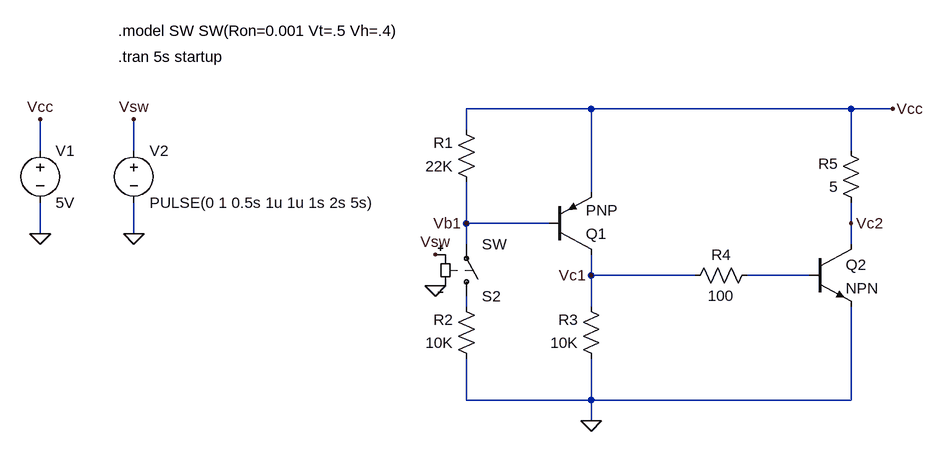
[diagram p0: schematic bjt-biasing-02.asc]
bjt-biasing-02.asc, the LTspice schematic file:
Version 4
SHEET 1 880 680
WIRE 32 -64 -160 -64
WIRE 432 -64 32 -64
WIRE 496 -64 432 -64
WIRE -160 -32 -160 -64
WIRE -816 0 -816 -48
WIRE -672 0 -672 -48
WIRE 432 0 432 -64
WIRE 32 64 32 -64
WIRE -160 112 -160 48
WIRE -32 112 -160 112
WIRE 432 112 432 80
WIRE -816 128 -816 80
WIRE -672 128 -672 80
WIRE -160 144 -160 112
WIRE 432 144 432 112
WIRE 32 192 32 160
WIRE 192 192 32 192
WIRE 368 192 272 192
WIRE -160 240 -160 224
WIRE 32 240 32 192
WIRE -160 384 -160 320
WIRE 32 384 32 320
WIRE 32 384 -160 384
WIRE 432 384 432 240
WIRE 432 384 32 384
WIRE 32 416 32 384
FLAG -816 128 0
FLAG -816 -48 Vcc
FLAG -672 128 0
FLAG -672 -48 Vsw
FLAG 32 416 0
FLAG 496 -64 Vcc
FLAG -160 112 Vb1
FLAG 32 192 Vc1
FLAG -208 160 Vsw
FLAG -208 208 0
FLAG 432 112 Vc2
SYMBOL voltage -816 -16 R0
WINDOW 123 0 0 Left 0
WINDOW 39 0 0 Left 0
SYMATTR InstName V1
SYMATTR Value 5V
SYMBOL res -144 64 R180
WINDOW 0 36 76 Left 2
WINDOW 3 36 40 Left 2
SYMATTR InstName R1
SYMATTR Value 22K
SYMBOL voltage -672 -16 R0
WINDOW 123 0 0 Left 0
WINDOW 39 0 0 Left 0
SYMATTR InstName V2
SYMATTR Value PULSE(0 1 0.5s 1u 1u 1s 2s 5s)
SYMBOL pnp -32 160 M180
SYMATTR InstName Q1
SYMBOL res -144 336 R180
WINDOW 0 36 76 Left 2
WINDOW 3 36 40 Left 2
SYMATTR InstName R2
SYMATTR Value 10K
SYMBOL sw -160 240 M180
SYMATTR InstName S2
SYMBOL npn 368 144 R0
SYMATTR InstName Q2
SYMBOL res 48 336 R180
WINDOW 0 36 76 Left 2
WINDOW 3 36 40 Left 2
SYMATTR InstName R3
SYMATTR Value 10K
SYMBOL res 448 96 R180
WINDOW 0 36 76 Left 2
WINDOW 3 36 40 Left 2
SYMATTR InstName R5
SYMATTR Value 5
SYMBOL res 176 208 R270
WINDOW 0 32 56 VTop 2
WINDOW 3 0 56 VBottom 2
SYMATTR InstName R4
SYMATTR Value 100
TEXT -696 -144 Left 2 !.tran 5s startup
TEXT -696 -184 Left 2 !.model SW SW(Ron=0.001 Vt=.5 Vh=.4)

The netlist it stands for:
* bjt-biasing-02.asc
V1 Vcc 0 5V
R1 Vb1 Vcc 22K
V2 Vsw 0 PULSE(0 1 0.5s 1u 1u 1s 2s 5s)
Q1 Vc1 Vb1 Vcc 0 PNP
R2 0 N002 10K
S2 N002 Vb1 Vsw 0 SW
Q2 Vc2 N001 0 0 NPN
R3 0 Vc1 10K
R5 Vc2 Vcc 5
R4 Vc1 N001 100
.model NPN NPN
.model PNP PNP
.lib standard.bjt
.tran 5s startup
.model SW SW(Ron=0.001 Vt=.5 Vh=.4)
.backanno
.end